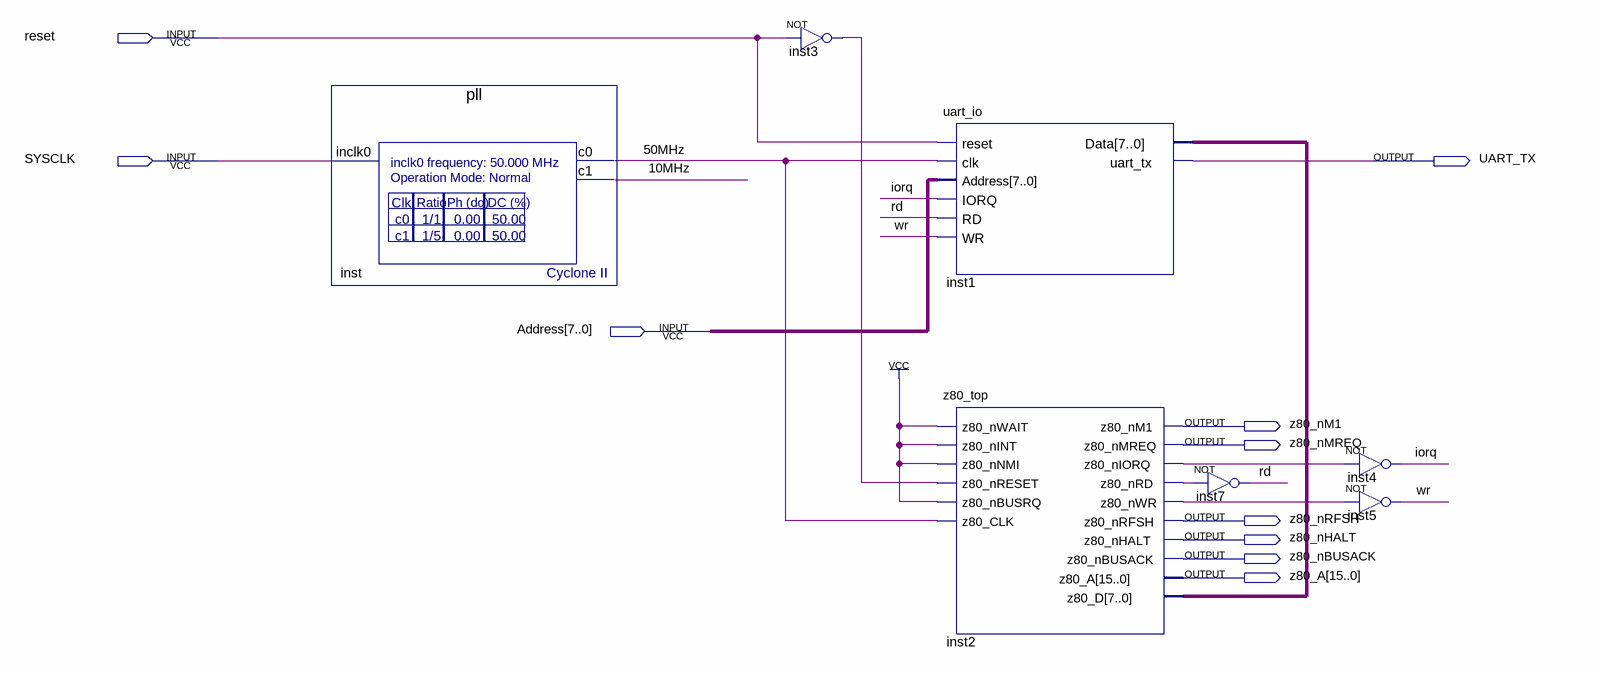
[diagram p0: schematic sheet]
// Quartus schematic host.bdf as structural Verilog: 7 symbols, 10 pins
module host (
  input  reset,
  input  SYSCLK,
  input  [7:0] Address,
  output UART_TX,
  output z80_nM1,
  output z80_nMREQ,
  output z80_nRFSH,
  output z80_nHALT,
  output z80_nBUSACK,
  output [15:0] z80_A
);

  wire \10MHz , \50MHz , inst2_z80_niorq, inst2_z80_nrd, inst2_z80_nwr, inst3_out, iorq, rd, wr;
  wire [7:0] inst1_data;

  pll inst (.inclk0(SYSCLK), .c0(\50MHz ), .c1(\10MHz ));
  not inst3 (inst3_out, reset);
  uart_io inst1 (
    .reset(reset), .clk(\50MHz ), .Address(Address), .IORQ(iorq), .RD(rd), .WR(wr), .uart_tx(UART_TX),
    .Data(inst1_data));
  z80_top inst2 (
    .z80_nWAIT(1'b1), .z80_nINT(1'b1), .z80_nNMI(1'b1), .z80_nRESET(inst3_out), .z80_nBUSRQ(1'b1),
    .z80_CLK(\50MHz ), .z80_nM1(z80_nM1), .z80_nMREQ(z80_nMREQ), .z80_nIORQ(inst2_z80_niorq),
    .z80_nRD(inst2_z80_nrd), .z80_nWR(inst2_z80_nwr), .z80_nRFSH(z80_nRFSH), .z80_nHALT(z80_nHALT),
    .z80_nBUSACK(z80_nBUSACK), .z80_A(z80_A), .z80_D(inst1_data));
  not inst7 (rd, inst2_z80_nrd);
  not inst4 (iorq, inst2_z80_niorq);
  not inst5 (wr, inst2_z80_nwr);
endmodule
